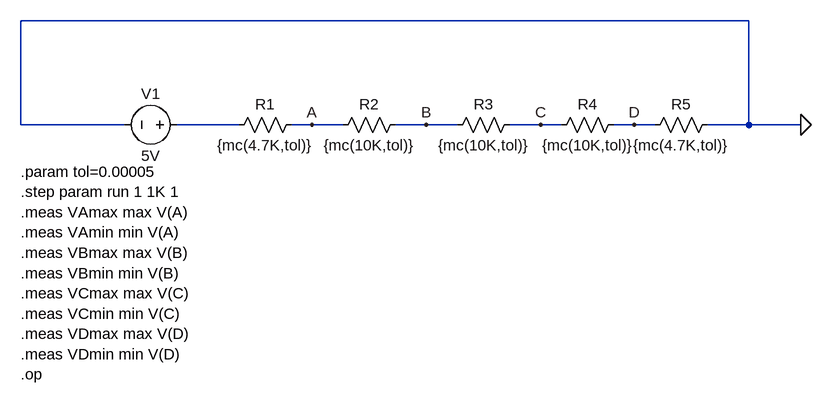
[diagram p0: schematic 3-5_Monte-Carlo-with-Different-Tolerances.asc]
3-5_Monte-Carlo-with-Different-Tolerances.asc, the LTspice schematic file:
Version 4.1
SHEET 1 984 680
WIRE 608 -128 -512 -128
WIRE -512 32 -512 -128
WIRE -352 32 -512 32
WIRE -176 32 -272 32
WIRE -64 32 -96 32
WIRE -16 32 -64 32
WIRE 112 32 64 32
WIRE 160 32 112 32
WIRE 288 32 240 32
WIRE 320 32 288 32
WIRE 432 32 400 32
WIRE 464 32 432 32
WIRE 608 32 608 -128
WIRE 608 32 544 32
WIRE 688 32 608 32
FLAG 688 32 0
FLAG -64 32 A
FLAG 112 32 B
FLAG 288 32 C
FLAG 432 32 D
SYMBOL res -80 16 R90
WINDOW 0 0 56 VBottom 2
WINDOW 3 32 56 VTop 2
SYMATTR InstName R1
SYMATTR Value {mc(4.7K,tol)}
SYMBOL res 80 16 R90
WINDOW 0 0 56 VBottom 2
WINDOW 3 32 56 VTop 2
SYMATTR InstName R2
SYMATTR Value {mc(10K,tol)}
SYMBOL voltage -256 32 R90
WINDOW 0 -32 56 VBottom 2
WINDOW 3 32 56 VTop 2
WINDOW 123 0 0 Left 0
WINDOW 39 0 0 Left 0
SYMATTR InstName V1
SYMATTR Value 5V
SYMBOL res 256 16 R90
WINDOW 0 0 56 VBottom 2
WINDOW 3 32 56 VTop 2
SYMATTR InstName R3
SYMATTR Value {mc(10K,tol)}
SYMBOL res 416 16 R90
WINDOW 0 0 56 VBottom 2
WINDOW 3 32 56 VTop 2
SYMATTR InstName R4
SYMATTR Value {mc(10K,tol)}
SYMBOL res 560 16 R90
WINDOW 0 0 56 VBottom 2
WINDOW 3 32 56 VTop 2
SYMATTR InstName R5
SYMATTR Value {mc(4.7K,tol)}
TEXT -512 104 Left 2 !.param tol=0.00005\n.step param run 1 1K 1\n.meas VAmax max V(A)\n.meas VAmin min V(A)\n.meas VBmax max V(B)\n.meas VBmin min V(B)\n.meas VCmax max V(C)\n.meas VCmin min V(C)\n.meas VDmax max V(D)\n.meas VDmin min V(D)\n.op

The netlist it stands for:
* 3-5_Monte-Carlo-with-Different-Tolerances.asc
R1 A N001 {mc(4.7K,tol)}
R2 B A {mc(10K,tol)}
V1 N001 0 5V
R3 C B {mc(10K,tol)}
R4 D C {mc(10K,tol)}
R5 0 D {mc(4.7K,tol)}
.param tol=0.00005
.step param run 1 1K 1
.meas VAmax max V(A)
.meas VAmin min V(A)
.meas VBmax max V(B)
.meas VBmin min V(B)
.meas VCmax max V(C)
.meas VCmin min V(C)
.meas VDmax max V(D)
.meas VDmin min V(D)
.op
.backanno
.end